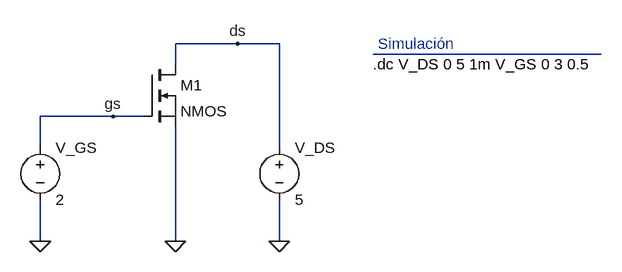
[diagram p0: schematic nMOS_vi.asc]
nMOS_vi.asc, the LTspice schematic file:
Version 4
SHEET 1 880 680
WIRE -128 -80 -224 -80
WIRE -64 -80 -128 -80
WIRE 432 -64 80 -64
WIRE -224 -48 -224 -80
WIRE -320 32 -432 32
WIRE -272 32 -320 32
WIRE -432 80 -432 32
WIRE -64 80 -64 -80
WIRE -432 224 -432 160
WIRE -224 224 -224 48
WIRE -64 224 -64 160
FLAG -432 224 0
FLAG -64 224 0
FLAG -224 224 0
FLAG -320 32 gs
FLAG -128 -80 ds
SYMBOL nmos -272 -48 R0
SYMATTR InstName M1
SYMBOL voltage -432 64 R0
WINDOW 123 0 0 Left 0
WINDOW 39 0 0 Left 0
SYMATTR InstName V_GS
SYMATTR Value 2
SYMBOL voltage -64 64 R0
WINDOW 123 0 0 Left 0
WINDOW 39 0 0 Left 0
SYMATTR InstName V_DS
SYMATTR Value 5
TEXT 80 -48 Left 2 !.dc V_DS 0 5 1m V_GS 0 3 0.5
TEXT 88 -80 Left 2 ;Simulación

The netlist it stands for:
* nMOS_vi.asc
M1 ds gs 0 0 NMOS
V_GS gs 0 2
V_DS ds 0 5
.model NMOS NMOS
.model PMOS PMOS
.lib standard.mos
.dc V_DS 0 5 1m V_GS 0 3 0.5
* Simulación
.backanno
.end